# EAGLE schematic steda_trasduttori_v1 (EAGLE 6.4)

## Sheet 1 of 6
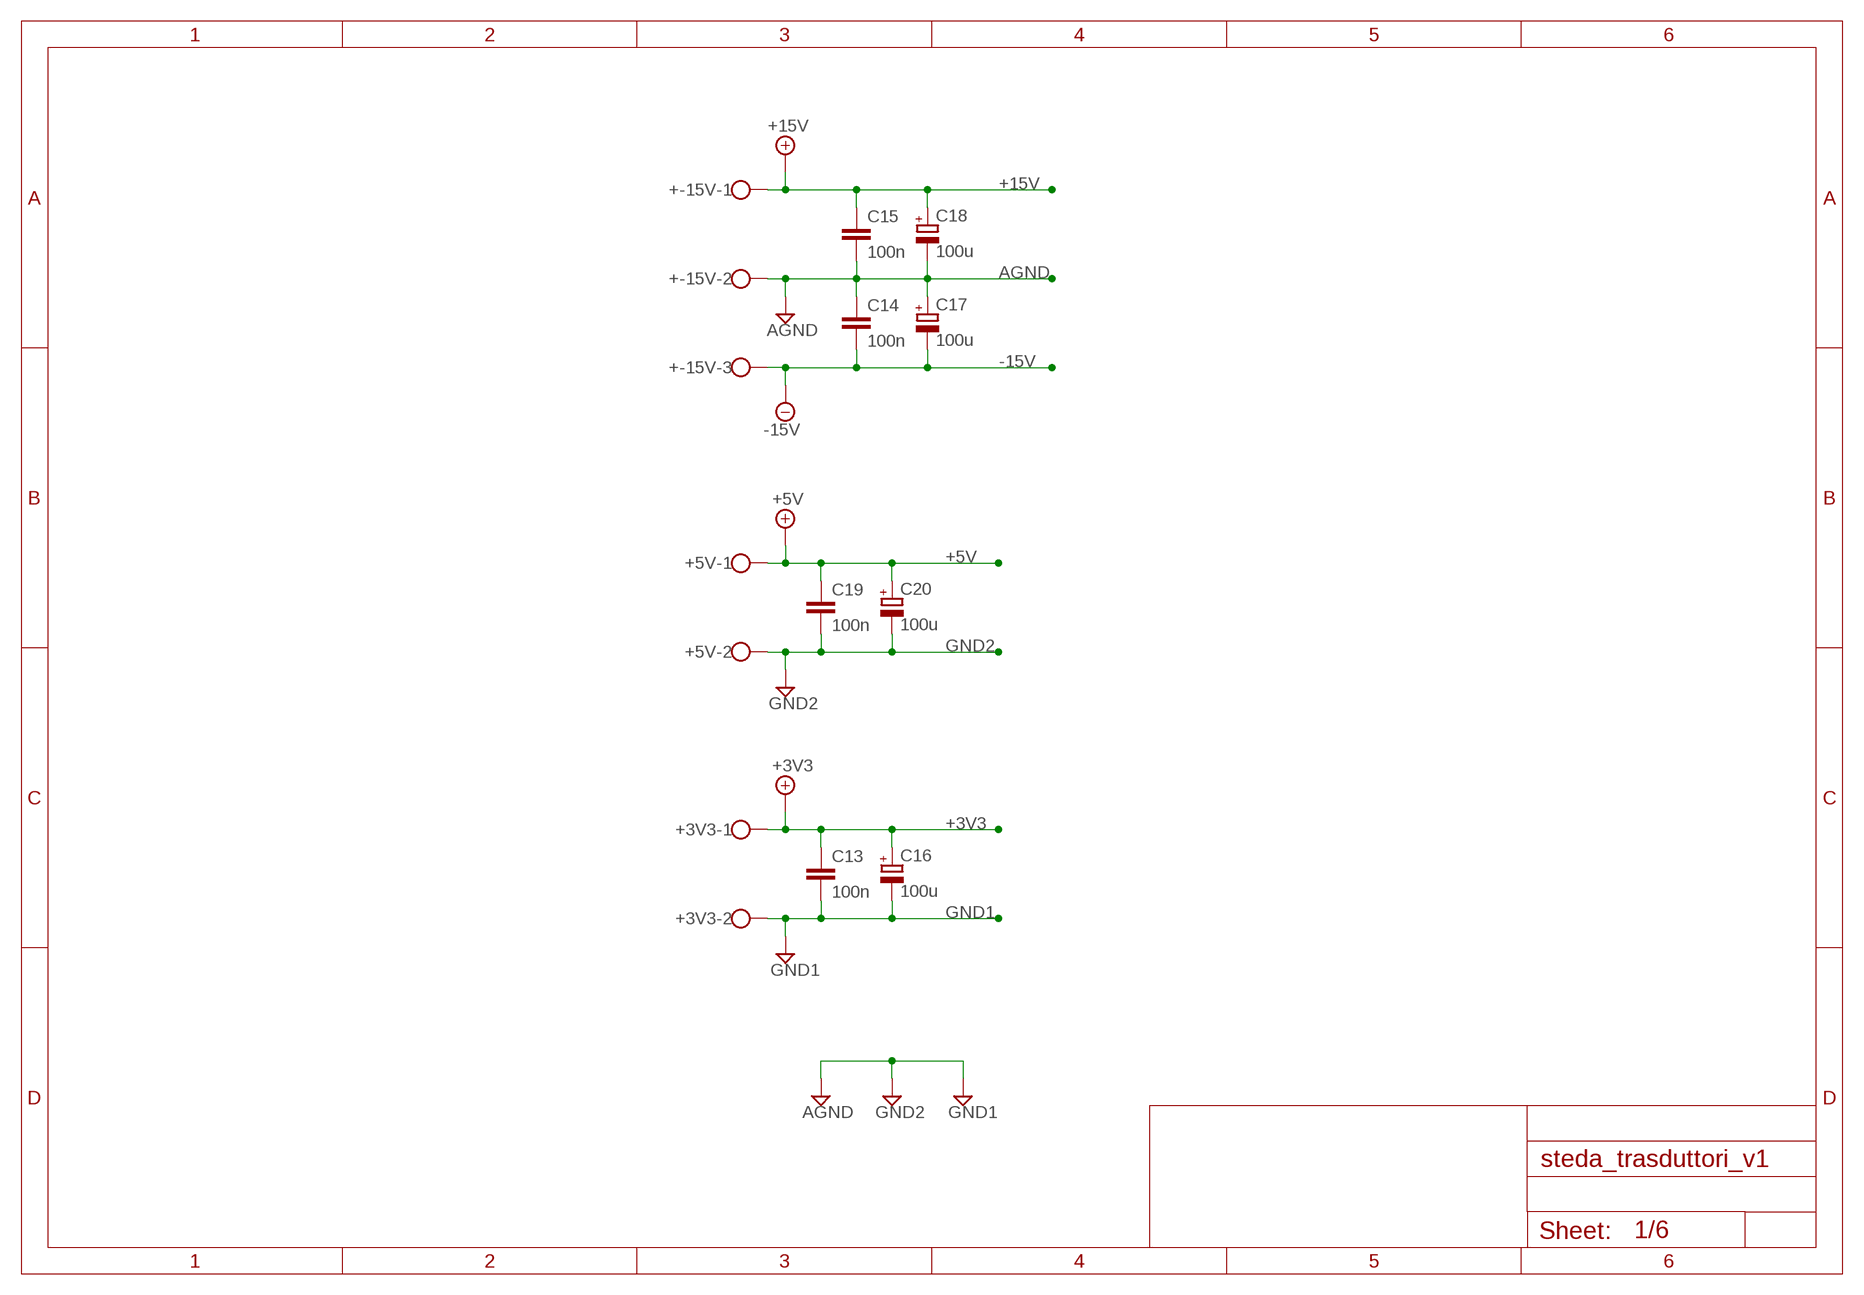
[diagram p0: schematic, sheet 1]

### Parts
+3V3  W237-102  [W237-102]
+5V  W237-102  [W237-102]
+-15V  W237-103  [W237-103]
C13  100n  C2,5-3  [C2.5-3]
C14  100n  C2,5-3  [C2.5-3]
C15  100n  C2,5-3  [C2.5-3]
C16  100u  CPOL-EUE2.5-7  [E2,5-7]
C17  100u  CPOL-EUE2.5-7  [E2,5-7]
C18  100u  CPOL-EUE2.5-7  [E2,5-7]
C19  100n  C2,5-3  [C2.5-3]
C20  100u  CPOL-EUE2.5-7  [E2,5-7]

### Nets
+3V3: +3V3.1 C13.1 C16.+
+5V: +5V.1 C19.1 C20.+ ; also sheet 2,4,6
+15V: +-15V.1 C15.1 C18.+ ; also sheet 2,3,4,5,6
-15V: +-15V.3 C14.2 C17.- ; also sheet 2,3,4,5
AGND: +-15V.2 C14.1 C15.2 C17.+ C18.- ; also sheet 2,3,4,5,6
GND1: +3V3.2 C13.2 C16.- ; also sheet 3
GND2: +5V.2 C19.2 C20.- ; supply symbol labelled AGND, GND1 ; also sheet 2,4,5,6

## Sheet 2 of 6
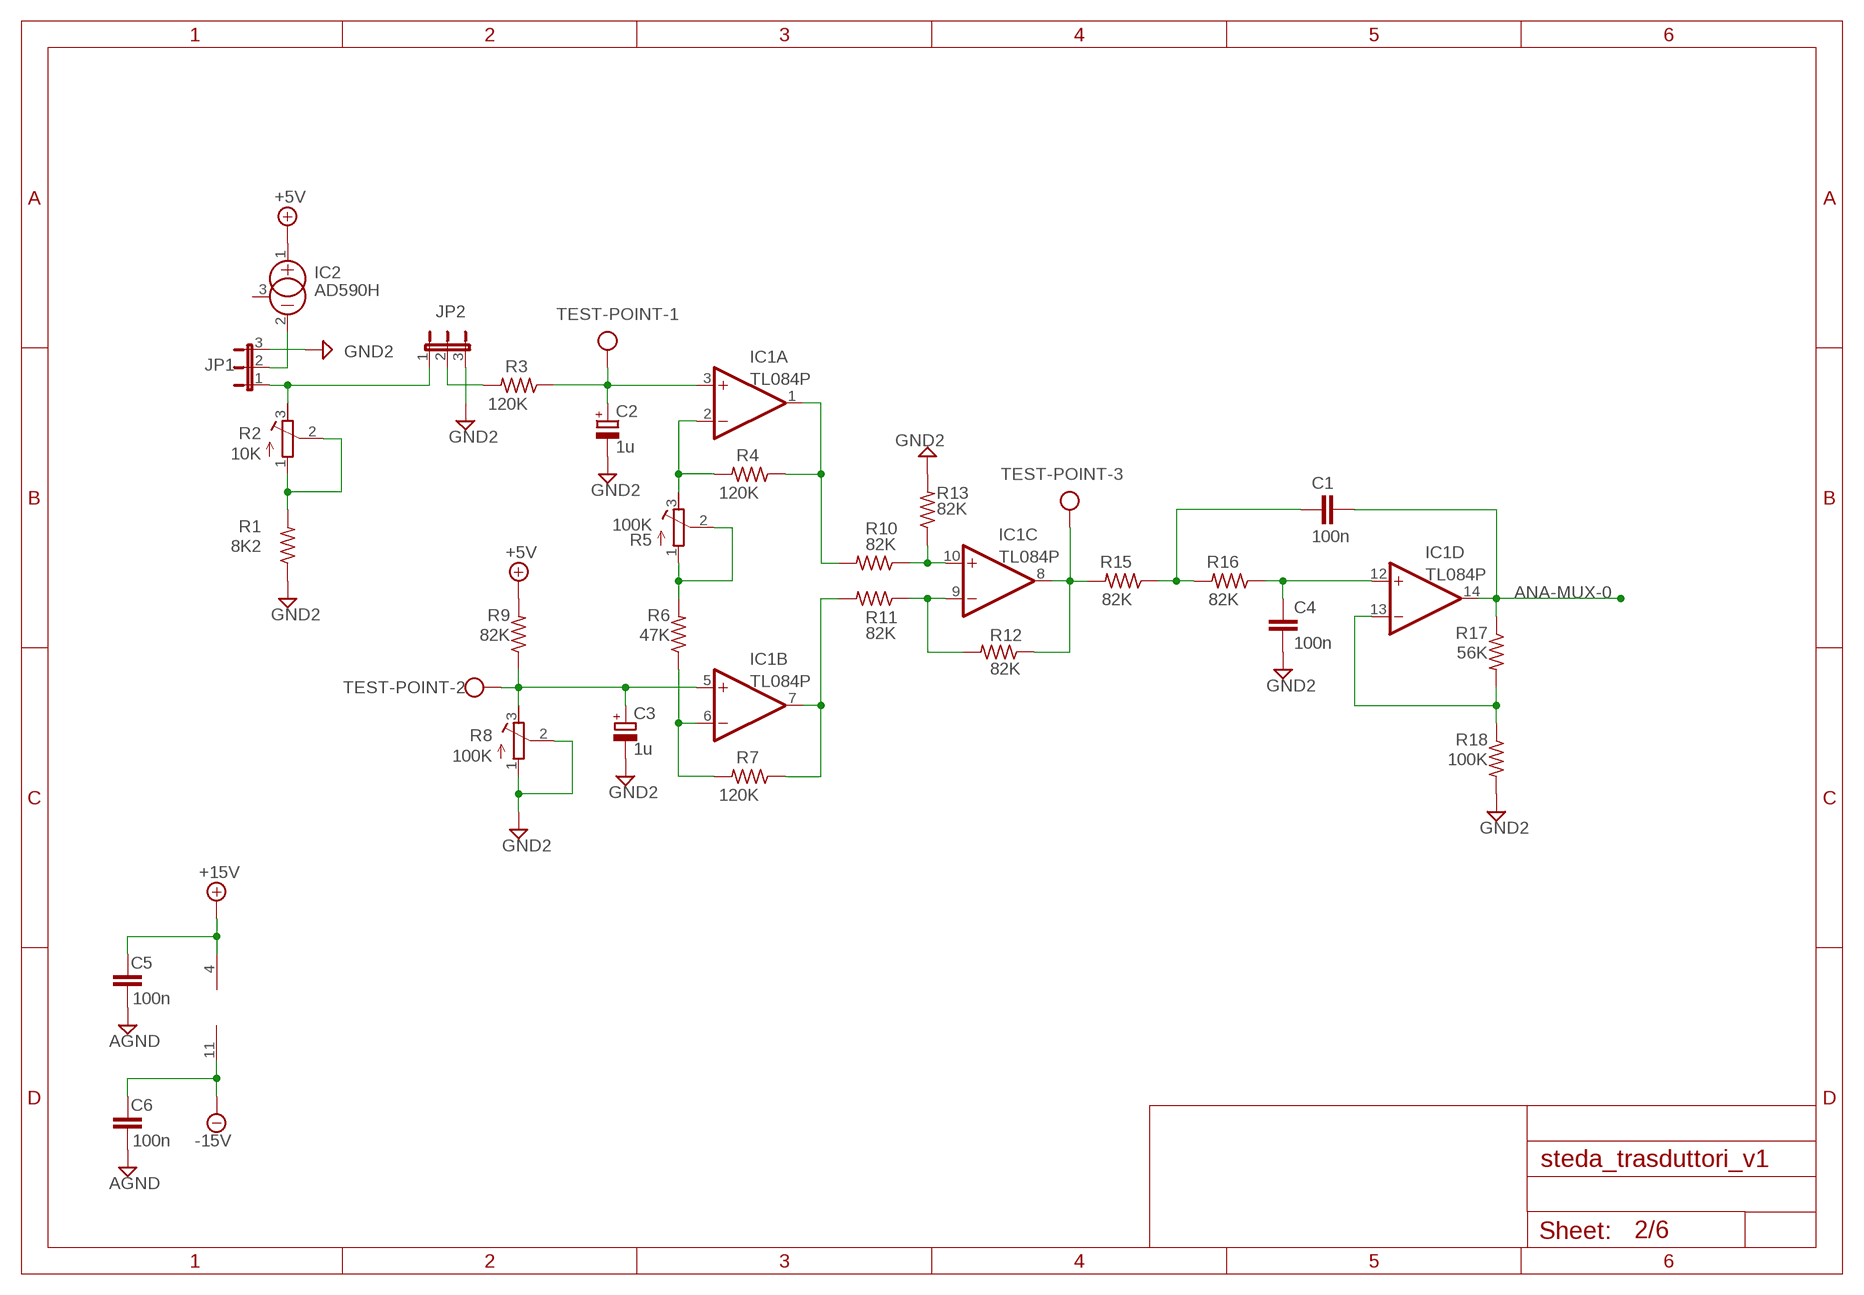
[diagram p1: schematic, sheet 2]

### Parts
C1  100n  C-EU025-024X044  [C025-024X044]
C2  1u  CPOL-EUB45181C  [B45181C]
C3  1u  CPOL-EUB45181C  [B45181C]
C4  100n  C-EU025-024X044  [C025-024X044]
C5  100n  C-EU025-024X044  [C025-024X044]
C6  100n  C-EU025-024X044  [C025-024X044]
IC1  TL084P  [DIL14]
IC2  AD590H  [TO18]
JP1  JP2E  [JP2]
JP2  JP2E  [JP2]
R1  8K2  R-US_0204/7  [0204/7]
R2  10K  R-TRIMM64W  [RTRIM64W]
R3  120K  R-US_0204/7  [0204/7]
R4  120K  R-US_0204/7  [0204/7]
R5  100K  R-TRIMM64W  [RTRIM64W]
R6  47K  R-US_0204/7  [0204/7]
R7  120K  R-US_0204/7  [0204/7]
R8  100K  R-TRIMM64W  [RTRIM64W]
R9  82K  R-US_0204/7  [0204/7]
R10  82K  R-US_0204/7  [0204/7]
R11  82K  R-US_0204/7  [0204/7]
R12  82K  R-US_0204/7  [0204/7]
R13  82K  R-US_0204/7  [0204/7]
R15  82K  R-US_0204/7  [0204/7]
R16  82K  R-US_0204/7  [0204/7]
R17  56K  R-US_0204/7  [0204/7]
R18  100K  R-US_0204/7  [0204/7]
TEST-POINT  W237-103  [W237-103]

### Nets
+5V: IC2.1(+) R9.2 ; also sheet 1,4,6
+15V: C5.2 IC1.4(P:V+) ; also sheet 1,3,4,5,6
-15V: C6.2 IC1.11(P:V-) ; also sheet 1,3,4,5
AGND: C5.1 C6.1 ; also sheet 1,3,4,5,6
ANA-MUX-0: C1.2 IC1.14(D:OUT) R17.1
GND2: C2.- C3.- C4.1 JP1.3 JP2.3 R1.1 R8.1(E) R8.2(S) R13.2 R18.2 ; also sheet 1,4,5,6
N$1: R1.2 R2.1(E) R2.2(S)
N$2: IC2.2(-) JP1.2
N$3: R5.1(E) R5.2(S) R6.2
N$4: C2.+ IC1.3(A:+IN) R3.1 TEST-POINT.1
N$5: IC1.2(A:-IN) R4.2 R5.3(A)
N$6: IC1.1(A:OUT) R4.1 R10.2
N$7: JP2.2 R3.2
N$8: JP1.1 JP2.1 R2.3(A)
N$9: C3.+ IC1.5(B:+IN) R8.3(A) R9.1 TEST-POINT.2
N$10: IC1.6(B:-IN) R6.1 R7.2
N$11: IC1.7(B:OUT) R7.1 R11.2
N$12: IC1.10(C:+IN) R10.1 R13.1
N$13: IC1.9(C:-IN) R11.1 R12.2
N$14: IC1.8(C:OUT) R12.1 R15.2 TEST-POINT.3
N$16: C1.1 R15.1 R16.2
N$17: C4.2 IC1.12(D:+IN) R16.1
N$18: IC1.13(D:-IN) R17.2 R18.1
Unconnected: IC2.3(CAN)

## Sheet 3 of 6
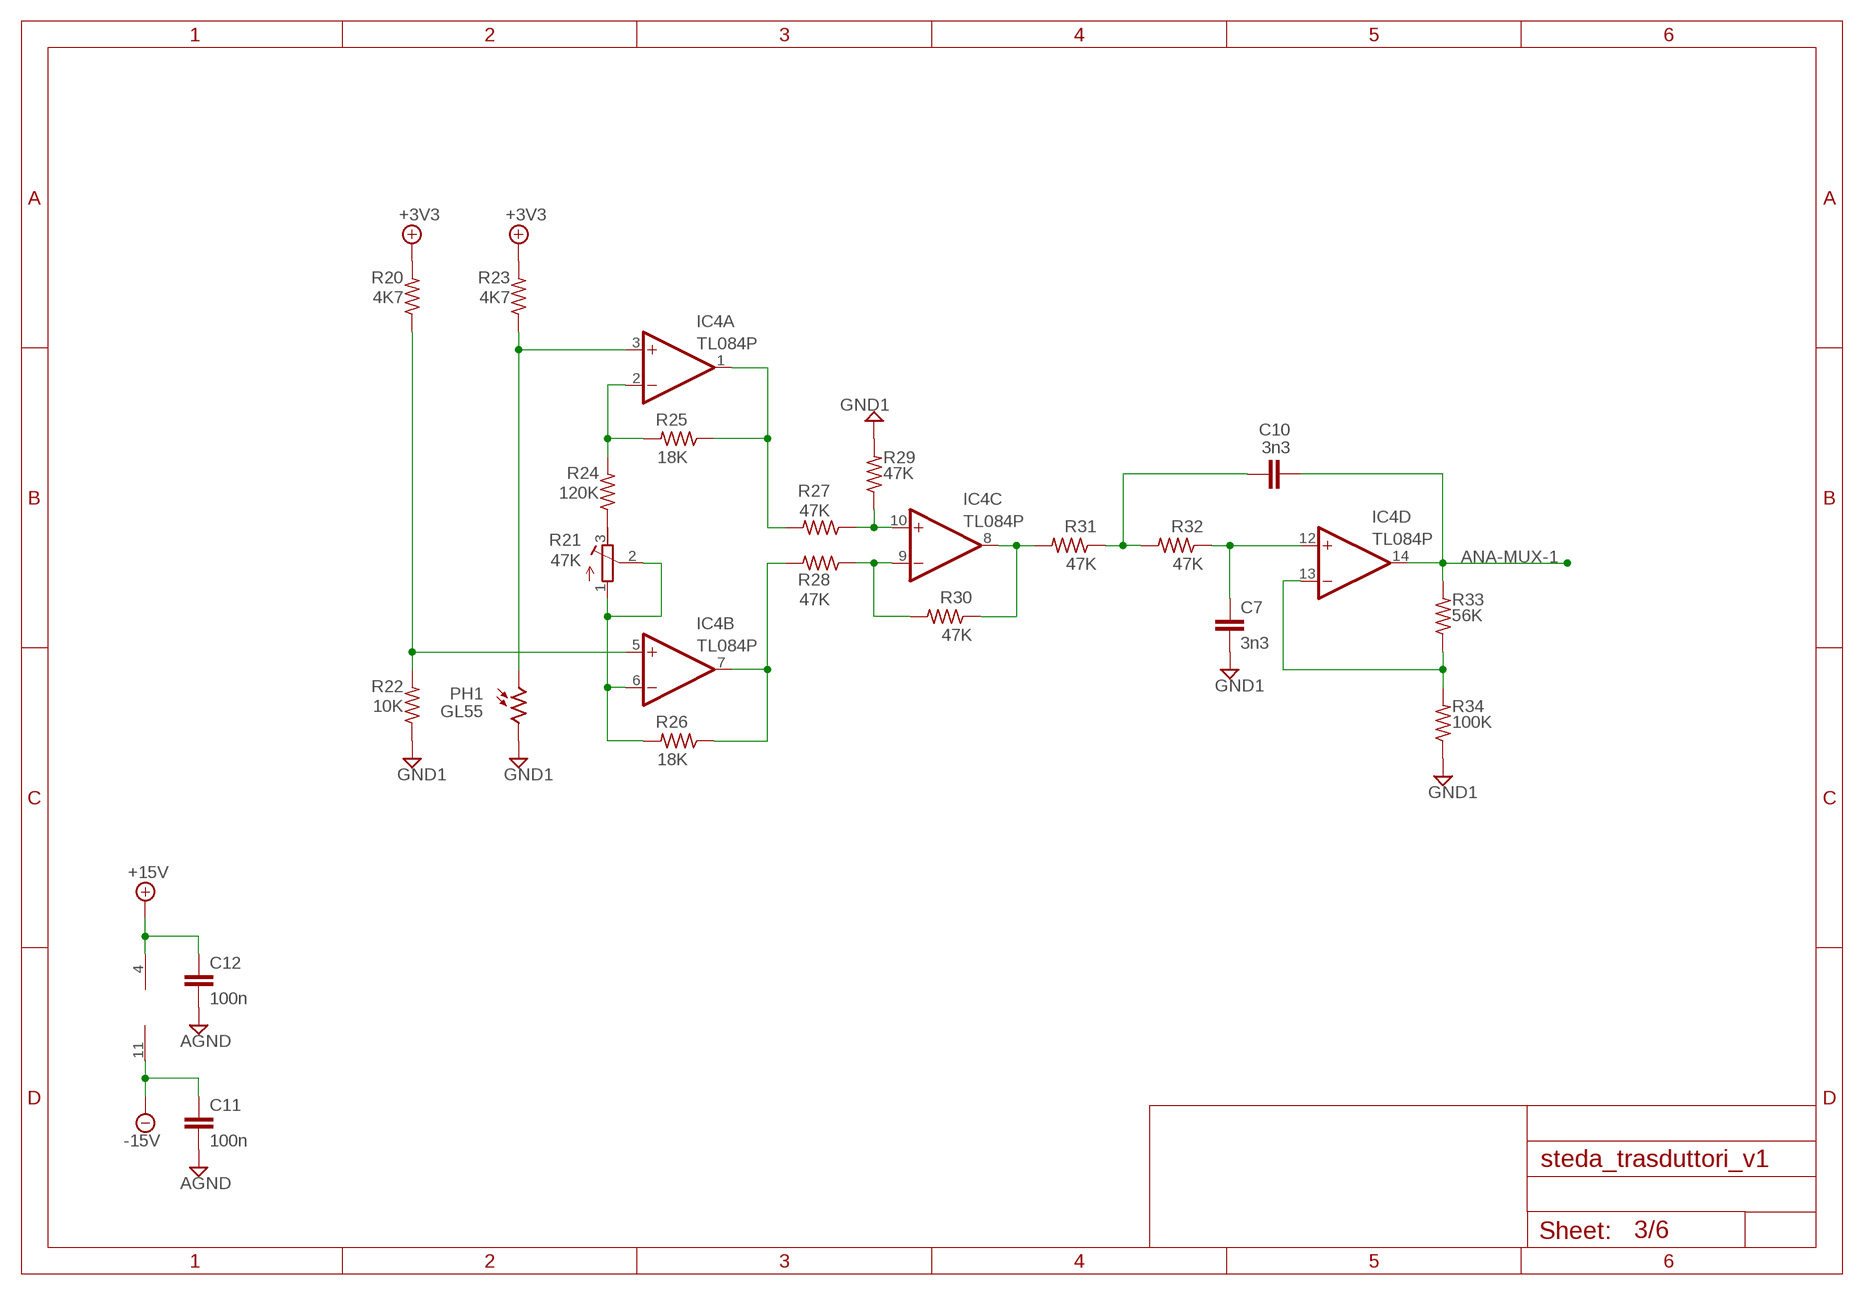
[diagram p2: schematic, sheet 3]

### Parts
C7  3n3  C-EU025-025X050  [C025-025X050]
C10  3n3  C-EU025-025X050  [C025-025X050]
C11  100n  C-EU025-025X050  [C025-025X050]
C12  100n  C-EU025-025X050  [C025-025X050]
IC4  TL084P  [DIL14]
PH1  GL55  B1060_23  [TO-8_B10]
R20  4K7  R-US_0204/7  [0204/7]
R21  47K  R-TRIMM64W  [RTRIM64W]
R22  10K  R-US_0204/7  [0204/7]
R23  4K7  R-US_0204/7  [0204/7]
R24  120K  R-US_0204/7  [0204/7]
R25  18K  R-US_0204/7  [0204/7]
R26  18K  R-US_0204/7  [0204/7]
R27  47K  R-US_0204/7  [0204/7]
R28  47K  R-US_0204/7  [0204/7]
R29  47K  R-US_0204/7  [0204/7]
R30  47K  R-US_0204/7  [0204/7]
R31  47K  R-US_0204/7  [0204/7]
R32  47K  R-US_0204/7  [0204/7]
R33  56K  R-US_0204/7  [0204/7]
R34  100K  R-US_0204/7  [0204/7]

### Nets
+4.1V: R20.2 R23.2 ; supply symbol labelled +3V3 ; also sheet 6
+15V: C12.1 IC4.4(P:V+) ; also sheet 1,2,4,5,6
-15V: C11.1 IC4.11(P:V-) ; also sheet 1,2,4,5
AGND: C11.2 C12.2 ; also sheet 1,2,4,5,6
ANA-MUX-1: C10.2 IC4.14(D:OUT) R33.2 ; also sheet 6
GND1: C7.2 PH1.2 R22.1 R29.2 R34.1 ; also sheet 1
N$28: IC4.5(B:+IN) R20.1 R22.2
N$29: IC4.3(A:+IN) PH1.1 R23.1
N$30: R21.3(A) R24.1
N$31: IC4.6(B:-IN) R21.1(E) R21.2(S) R26.2
N$32: IC4.7(B:OUT) R26.1 R28.2
N$33: IC4.1(A:OUT) R25.1 R27.2
N$34: IC4.2(A:-IN) R24.2 R25.2
N$35: IC4.10(C:+IN) R27.1 R29.1
N$36: IC4.9(C:-IN) R28.1 R30.2
N$37: IC4.8(C:OUT) R30.1 R31.2
N$38: C7.1 IC4.12(D:+IN) R32.1
N$39: IC4.13(D:-IN) R33.1 R34.2
N$40: C10.1 R31.1 R32.2

## Sheet 4 of 6
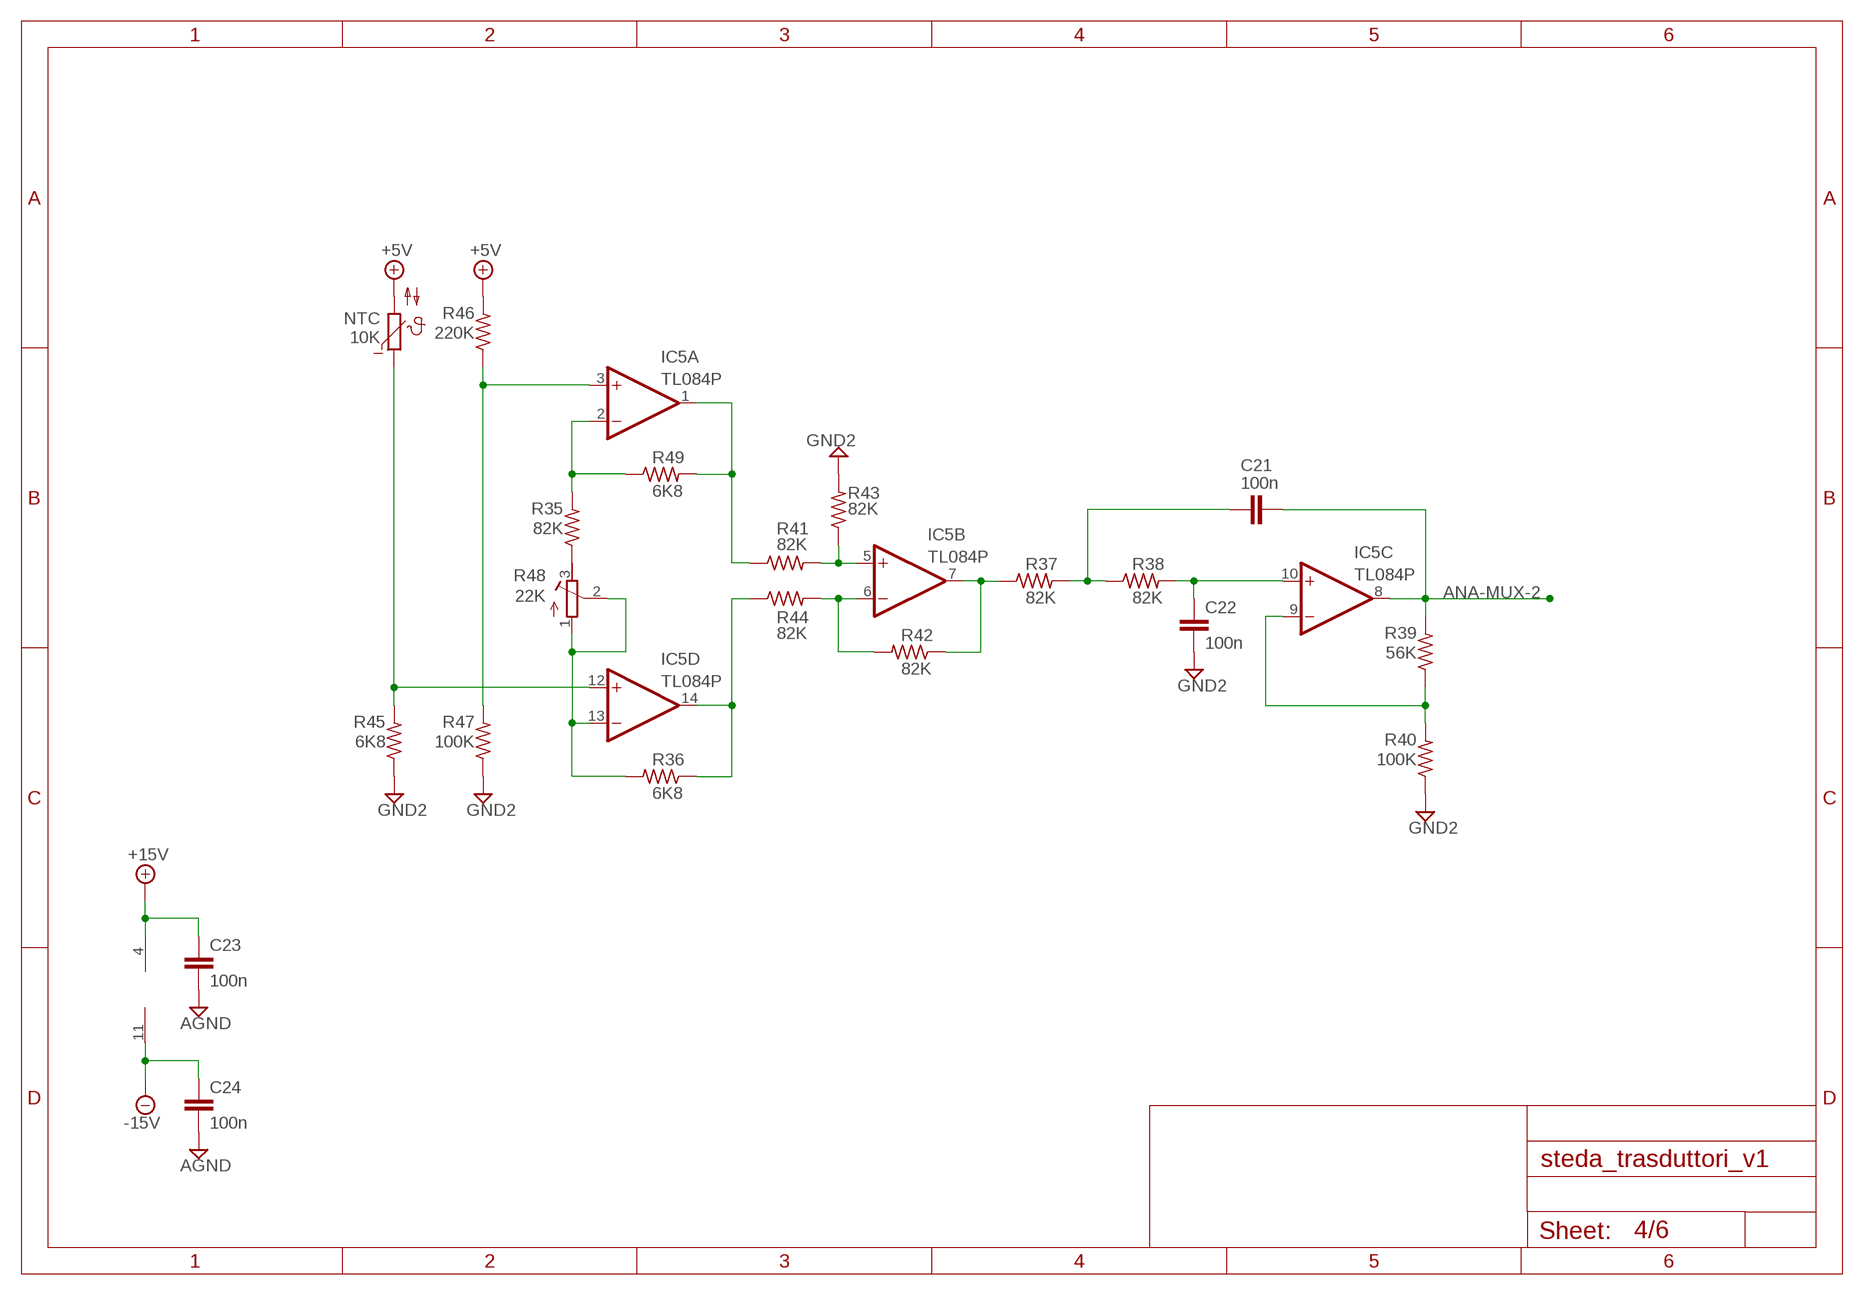
[diagram p3: schematic, sheet 4]

### Parts
C21  100n  C-EU025-025X050  [C025-025X050]
C22  100n  C-EU025-025X050  [C025-025X050]
C23  100n  C-EU025-025X050  [C025-025X050]
C24  100n  C-EU025-025X050  [C025-025X050]
IC5  TL084P  [DIL14]
NTC  10K  NTC640  [P640]
R35  82K  R-US_0204/7  [0204/7]
R36  6K8  R-US_0204/7  [0204/7]
R37  82K  R-US_0204/7  [0204/7]
R38  82K  R-US_0204/7  [0204/7]
R39  56K  R-US_0204/7  [0204/7]
R40  100K  R-US_0204/7  [0204/7]
R41  82K  R-US_0204/7  [0204/7]
R42  82K  R-US_0204/7  [0204/7]
R43  82K  R-US_0204/7  [0204/7]
R44  82K  R-US_0204/7  [0204/7]
R45  6K8  R-US_0204/7  [0204/7]
R46  220K  R-US_0204/7  [0204/7]
R47  100K  R-US_0204/7  [0204/7]
R48  22K  R-TRIMM64W  [RTRIM64W]
R49  6K8  R-US_0204/7  [0204/7]

### Nets
+5V: NTC.2 R46.2 ; also sheet 1,2,6
+15V: C23.1 IC5.4(P:V+) ; also sheet 1,2,3,5,6
-15V: C24.1 IC5.11(P:V-) ; also sheet 1,2,3,5
AGND: C23.2 C24.2 ; also sheet 1,2,3,5,6
ANA-MUX-2: C21.2 IC5.8(C:OUT) R39.2 ; also sheet 6
GND2: C22.2 R40.1 R43.2 R45.1 R47.1 ; also sheet 1,2,5,6
N$41: C22.1 IC5.10(C:+IN) R38.2
N$42: IC5.9(C:-IN) R39.1 R40.2
N$43: C21.1 R37.2 R38.1
N$44: IC5.12(D:+IN) NTC.1 R45.2
N$45: R35.1 R48.3(A)
N$46: IC5.2(A:-IN) R35.2 R49.1
N$47: IC5.1(A:OUT) R44.1 R49.2
N$48: IC5.13(D:-IN) R36.2 R48.1(E) R48.2(S)
N$49: IC5.14(D:OUT) R36.1 R41.1
N$50: IC5.6(B:-IN) R41.2 R42.2
N$51: IC5.5(B:+IN) R43.1 R44.2
N$52: IC5.7(B:OUT) R37.1 R42.1
N$53: IC5.3(A:+IN) R46.1 R47.2

## Sheet 5 of 6
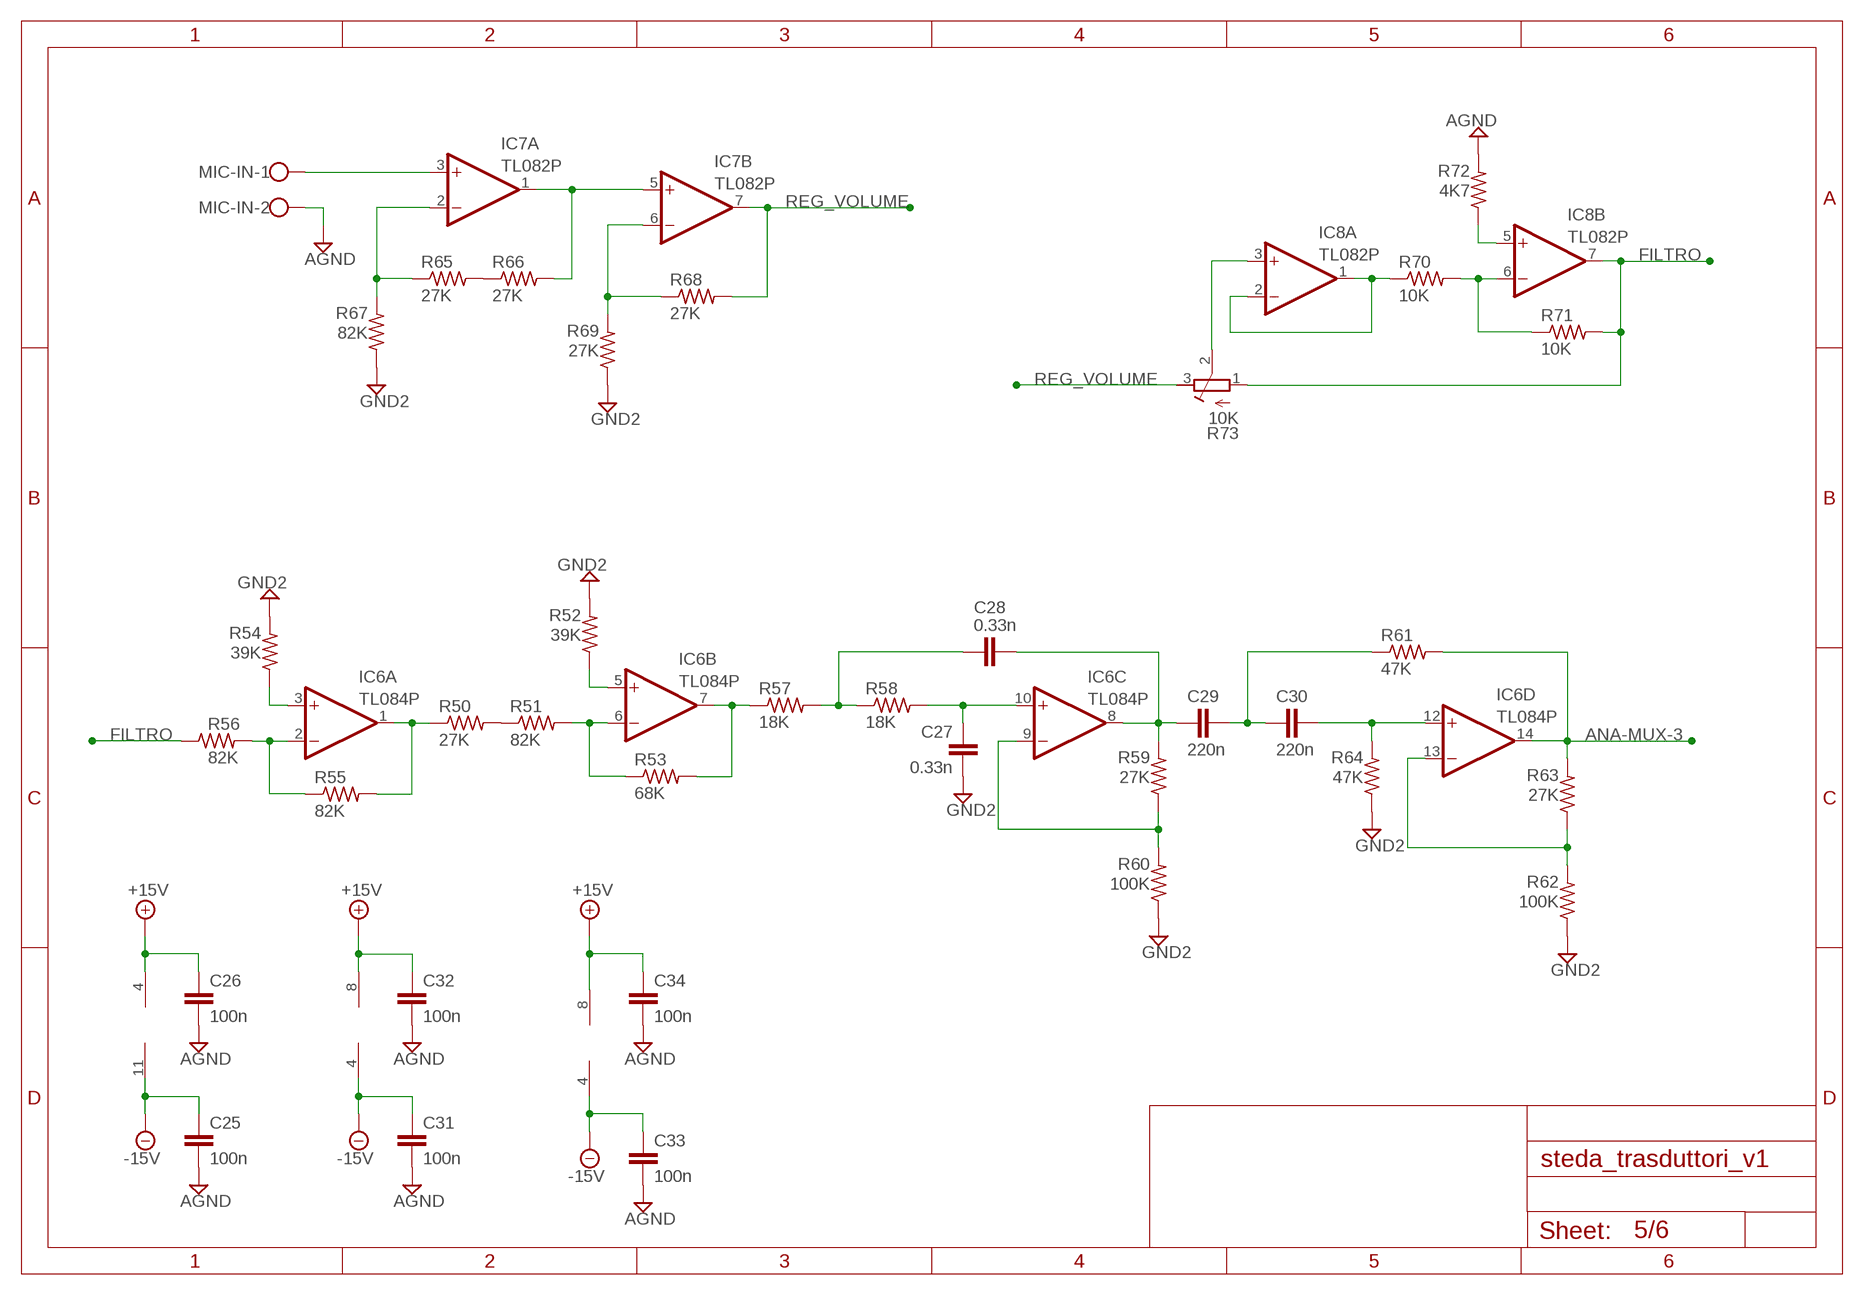
[diagram p4: schematic, sheet 5]

### Parts
C25  100n  C-EU025-025X050  [C025-025X050]
C26  100n  C-EU025-025X050  [C025-025X050]
C27  0.33n  C-EU025-025X050  [C025-025X050]
C28  0.33n  C-EU025-025X050  [C025-025X050]
C29  220n  C-EU025-025X050  [C025-025X050]
C30  220n  C-EU025-025X050  [C025-025X050]
C31  100n  C-EU025-025X050  [C025-025X050]
C32  100n  C-EU025-025X050  [C025-025X050]
C33  100n  C-EU025-025X050  [C025-025X050]
C34  100n  C-EU025-025X050  [C025-025X050]
IC6  TL084P  [DIL14]
IC7  TL082P  [DIL08]
IC8  TL082P  [DIL08]
MIC-IN  W237-102  [W237-102]
R50  27K  R-US_0204/7  [0204/7]
R51  82K  R-US_0204/7  [0204/7]
R52  39K  R-US_0204/7  [0204/7]
R53  68K  R-US_0204/7  [0204/7]
R54  39K  R-US_0204/7  [0204/7]
R55  82K  R-US_0204/7  [0204/7]
R56  82K  R-US_0204/7  [0204/7]
R57  18K  R-US_0204/7  [0204/7]
R58  18K  R-US_0204/7  [0204/7]
R59  27K  R-US_0204/7  [0204/7]
R60  100K  R-US_0204/7  [0204/7]
R61  47K  R-US_0204/7  [0204/7]
R62  100K  R-US_0204/7  [0204/7]
R63  27K  R-US_0204/7  [0204/7]
R64  47K  R-US_0204/7  [0204/7]
R65  27K  R-US_0204/7  [0204/7]
R66  27K  R-US_0204/7  [0204/7]
R67  82K  R-US_0204/7  [0204/7]
R68  27K  R-US_0204/7  [0204/7]
R69  27K  R-US_0204/7  [0204/7]
R70  10K  R-US_0204/7  [0204/7]
R71  10K  R-US_0204/7  [0204/7]
R72  4K7  R-US_0204/7  [0204/7]
R73  10K  R-TRIMM64W  [RTRIM64W]

### Nets
+15V: C26.1 C32.1 C34.1 IC6.4(P:V+) IC7.8(P:V+) IC8.8(P:V+) ; also sheet 1,2,3,4,6
-15V: C25.1 C31.1 C33.1 IC6.11(P:V-) IC7.4(P:V-) IC8.4(P:V-) ; also sheet 1,2,3,4
AGND: C25.2 C26.2 C31.2 C32.2 C33.2 C34.2 MIC-IN.2 R72.2 ; also sheet 1,2,3,4,6
ANA-MUX-3: IC6.14(D:OUT) R61.2 R63.2
FILTRO: IC8.7(B:OUT) R56.1 R71.2 R73.1(A)
GND2: C27.2 R52.2 R54.2 R60.1 R62.1 R64.1 R67.1 R69.1 ; also sheet 1,2,4,6
N$54: R50.2 R51.1
N$55: IC6.2(A:-IN) R55.1 R56.2
N$56: IC6.1(A:OUT) R50.1 R55.2
N$57: IC6.3(A:+IN) R54.1
N$58: IC6.6(B:-IN) R51.2 R53.1
N$59: IC6.5(B:+IN) R52.1
N$60: C27.1 IC6.10(C:+IN) R58.2
N$61: C28.1 R57.2 R58.1
N$62: C28.2 C29.1 IC6.8(C:OUT) R59.2
N$63: IC6.9(C:-IN) R59.1 R60.2
N$64: C30.2 IC6.12(D:+IN) R64.2
N$65: IC6.7(B:OUT) R53.2 R57.1
N$66: IC6.13(D:-IN) R62.2 R63.1
N$67: R65.2 R66.1
N$68: C29.2 C30.1 R61.1
N$69: IC7.2(A:-IN) R65.1 R67.2
N$70: IC7.3(A:+IN) MIC-IN.1
N$72: IC7.6(B:-IN) R68.1 R69.2
N$73: IC8.3(A:+IN) R73.2(S)
N$74: IC7.1(A:OUT) IC7.5(B:+IN) R66.2
N$76: IC8.6(B:-IN) R70.2 R71.1
N$77: IC8.5(B:+IN) R72.1
N$78: IC8.1(A:OUT) IC8.2(A:-IN) R70.1
REG_VOLUME: IC7.7(B:OUT) R68.2 R73.3(E)

## Sheet 6 of 6
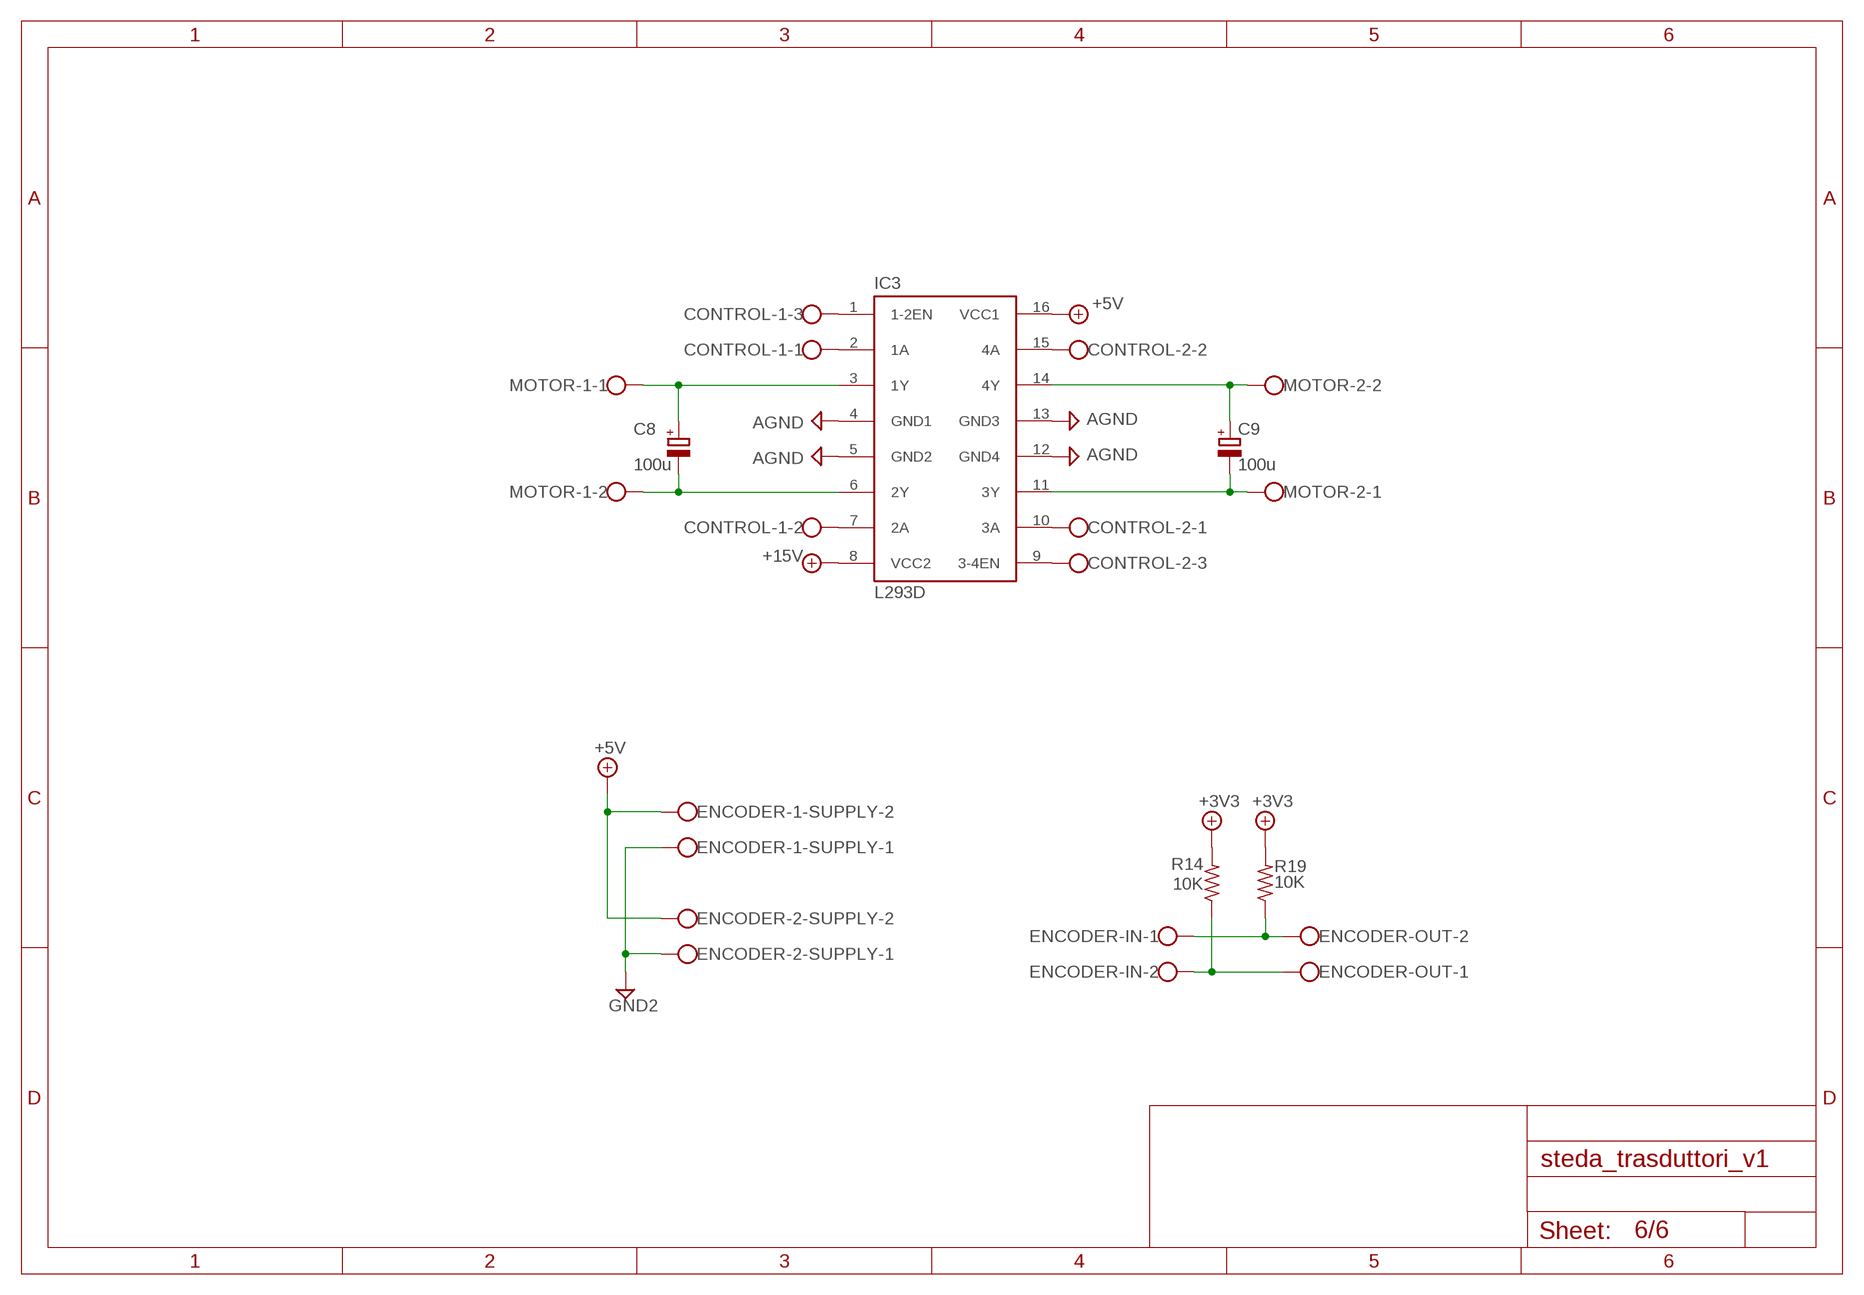
[diagram p5: schematic, sheet 6]

### Parts
C8  100u  CPOL-EUB45181B  [B45181B]
C9  100u  CPOL-EUB45181B  [B45181B]
CONTROL-1  W237-103  [W237-103]
CONTROL-2  W237-103  [W237-103]
ENCODER-1-SUPPLY  W237-102  [W237-102]
ENCODER-2-SUPPLY  W237-102  [W237-102]
ENCODER-IN  W237-102  [W237-102]
ENCODER-OUT  W237-102  [W237-102]
IC3  L293D  [DIL16]
MOTOR-1  W237-102  [W237-102]
MOTOR-2  W237-102  [W237-102]
R14  10K  R-US_0204/7  [0204/7]
R19  10K  R-US_0204/7  [0204/7]

### Nets
+4.1V: R14.2 R19.2 ; supply symbol labelled +3V3 ; also sheet 3
+5V: ENCODER-1-SUPPLY.2 ENCODER-2-SUPPLY.2 IC3.16(VCC1) ; also sheet 1,2,4
+15V: IC3.8(VCC2) ; also sheet 1,2,3,4,5
AGND: IC3.4(GND1) IC3.5(GND2) IC3.12(GND4) IC3.13(GND3) ; also sheet 1,2,3,4,5
ANA-MUX-1: ENCODER-IN.2 ENCODER-OUT.1 R14.1 ; also sheet 3
ANA-MUX-2: ENCODER-IN.1 ENCODER-OUT.2 R19.1 ; also sheet 4
GND2: ENCODER-1-SUPPLY.1 ENCODER-2-SUPPLY.1 ; also sheet 1,2,4,5
N$15: C8.+ IC3.3(1Y) MOTOR-1.1
N$19: C8.- IC3.6(2Y) MOTOR-1.2
N$20: C9.- IC3.11(3Y) MOTOR-2.1
N$21: C9.+ IC3.14(4Y) MOTOR-2.2
N$22: CONTROL-1.1 IC3.2(1A)
N$23: CONTROL-1.2 IC3.7(2A)
N$24: CONTROL-1.3 IC3.1(1-2EN)
N$25: CONTROL-2.3 IC3.9(3-4EN)
N$26: CONTROL-2.1 IC3.10(3A)
N$27: CONTROL-2.2 IC3.15(4A)

## Library data of the parts
+3V3 +5V ENCODER-1-SUPPLY ENCODER-2-SUPPLY ENCODER-IN ENCODER-OUT MIC-IN MOTOR-1 MOTOR-2 = con-wago-500:W237-102: WAGO SCREW CLAMP; MPN: 237-102; OC_FARNELL: unknown; OC_NEWARK: 70K9898
+-15V CONTROL-1 CONTROL-2 TEST-POINT = con-wago-500:W237-103: WAGO SCREW CLAMP; MPN: 237-103; OC_FARNELL: unknown; OC_NEWARK: 18M7116
C1 C4-C7 C10-C12 C21-C34 = rcl:C-EU: CAPACITOR, European symbol
C2 C3 C8 C9 C16-C18 C20 = rcl:CPOL-EU: POLARIZED CAPACITOR, European symbol
C13-C15 C19 = capacitor-wima:C: CAPACITOR naming: grid - package width
IC1 IC4-IC6 = linear:TL084: OP AMP
IC2 = linear:AD590H: TEMPERATURE SENSOR current output
IC3 = st-microelectronics:L293D: PUSH-PULL 4 CHANNEL DRIVER; MPN: L293D; OC_FARNELL: 9589619; OC_NEWARK: 56P8249
IC7 IC8 = linear:TL082: OP AMP
JP1 JP2 = jumper:JP2E: JUMPER
NTC = ptc-ntc:NTC640: PHILIPS NTC; OC_FARNELL: unknown; OC_NEWARK: unknown
PH1 = photo-elements:?1060*: Sensor Street Light control Source: http://optoelectronics.perkinelmer.com/content/Datasheets/DTS_PhotocellsB1060.pdf; TYPE: GL55
R1 R3 R4 R6 R7 R9-R20 R22-R34 R50-R72 = rcl:R-US_: RESISTOR, American symbol
R2 R5 R8 R21 R48 = resistor:R-TRIMM: Trimm resistor
R35-R47 R49 = resistor:R-US_: RESISTOR, American symbol
R73 = rcl:R-TRIMM: Trimm resistor